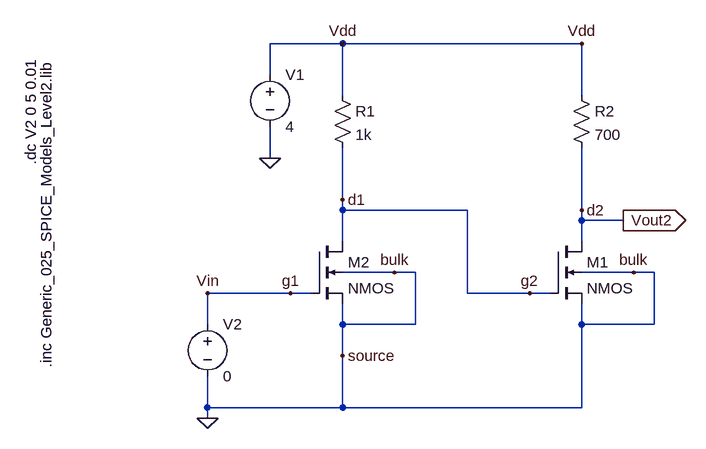
[diagram p0: schematic circuito_2.asc]
circuito_2.asc, the LTspice schematic file:
Version 4
SHEET 1 2972 680
WIRE 160 -240 48 -240
WIRE 528 -240 160 -240
WIRE 48 -192 48 -240
WIRE 160 -160 160 -240
WIRE 528 -160 528 -240
WIRE 48 -64 48 -112
WIRE 160 0 160 -80
WIRE 160 16 160 0
WIRE 352 16 160 16
WIRE 528 16 528 -80
WIRE 528 32 528 16
WIRE 592 32 528 32
WIRE 160 64 160 16
WIRE 528 64 528 32
WIRE 240 112 160 112
WIRE 272 112 240 112
WIRE 608 112 528 112
WIRE 640 112 608 112
WIRE 80 144 -48 144
WIRE 112 144 80 144
WIRE 352 144 352 16
WIRE 448 144 352 144
WIRE 480 144 448 144
WIRE -48 192 -48 144
WIRE 160 192 160 160
WIRE 272 192 272 112
WIRE 272 192 160 192
WIRE 528 192 528 160
WIRE 640 192 640 112
WIRE 640 192 528 192
WIRE 160 240 160 192
WIRE -48 320 -48 272
WIRE 160 320 160 240
WIRE 160 320 -48 320
WIRE 528 320 528 192
WIRE 528 320 160 320
WIRE -48 336 -48 320
FLAG 48 -64 0
FLAG -48 336 0
FLAG -48 144 Vin
FLAG 160 -240 Vdd
FLAG 240 112 bulk
FLAG 592 32 Vout2
IOPIN 592 32 Out
FLAG 528 -240 Vdd
FLAG 608 112 bulk
FLAG 80 144 g1
FLAG 448 144 g2
FLAG 160 0 d1
FLAG 528 16 d2
FLAG 160 240 source
SYMBOL voltage 48 -208 R0
WINDOW 123 0 0 Left 2
WINDOW 39 0 0 Left 2
SYMATTR InstName V1
SYMATTR Value 4
SYMBOL voltage -48 176 R0
WINDOW 123 0 0 Left 2
WINDOW 39 0 0 Left 2
SYMATTR InstName V2
SYMATTR Value 0
SYMBOL res 144 -176 R0
SYMATTR InstName R1
SYMATTR Value 1k
SYMBOL nmos4 112 64 R0
SYMATTR InstName M2
SYMATTR Value2 l=0.25u w=40u
SYMBOL res 512 -176 R0
SYMATTR InstName R2
SYMATTR Value 700
SYMBOL nmos4 480 64 R0
SYMATTR InstName M1
SYMATTR Value2 l=0.25u w=40u
TEXT -296 -216 VRight 2 !.inc Generic_025_SPICE_Models_Level2.lib
TEXT -320 -216 VRight 2 !.dc V2 0 5 0.01

The netlist it stands for:
* circuito_2.asc
V1 Vdd 0 4
V2 g1 0 0
R1 Vdd d1 1k
M2 d1 g1 0 0 NMOS l=0.25u w=40u
R2 Vdd d2 700
M1 d2 d1 0 0 NMOS l=0.25u w=40u
.model NMOS NMOS
.model PMOS PMOS
.lib standard.mos
.inc Generic_025_SPICE_Models_Level2.lib
.dc V2 0 5 0.01
.backanno
.end